# EAGLE design sdEval (EAGLE 4.16)
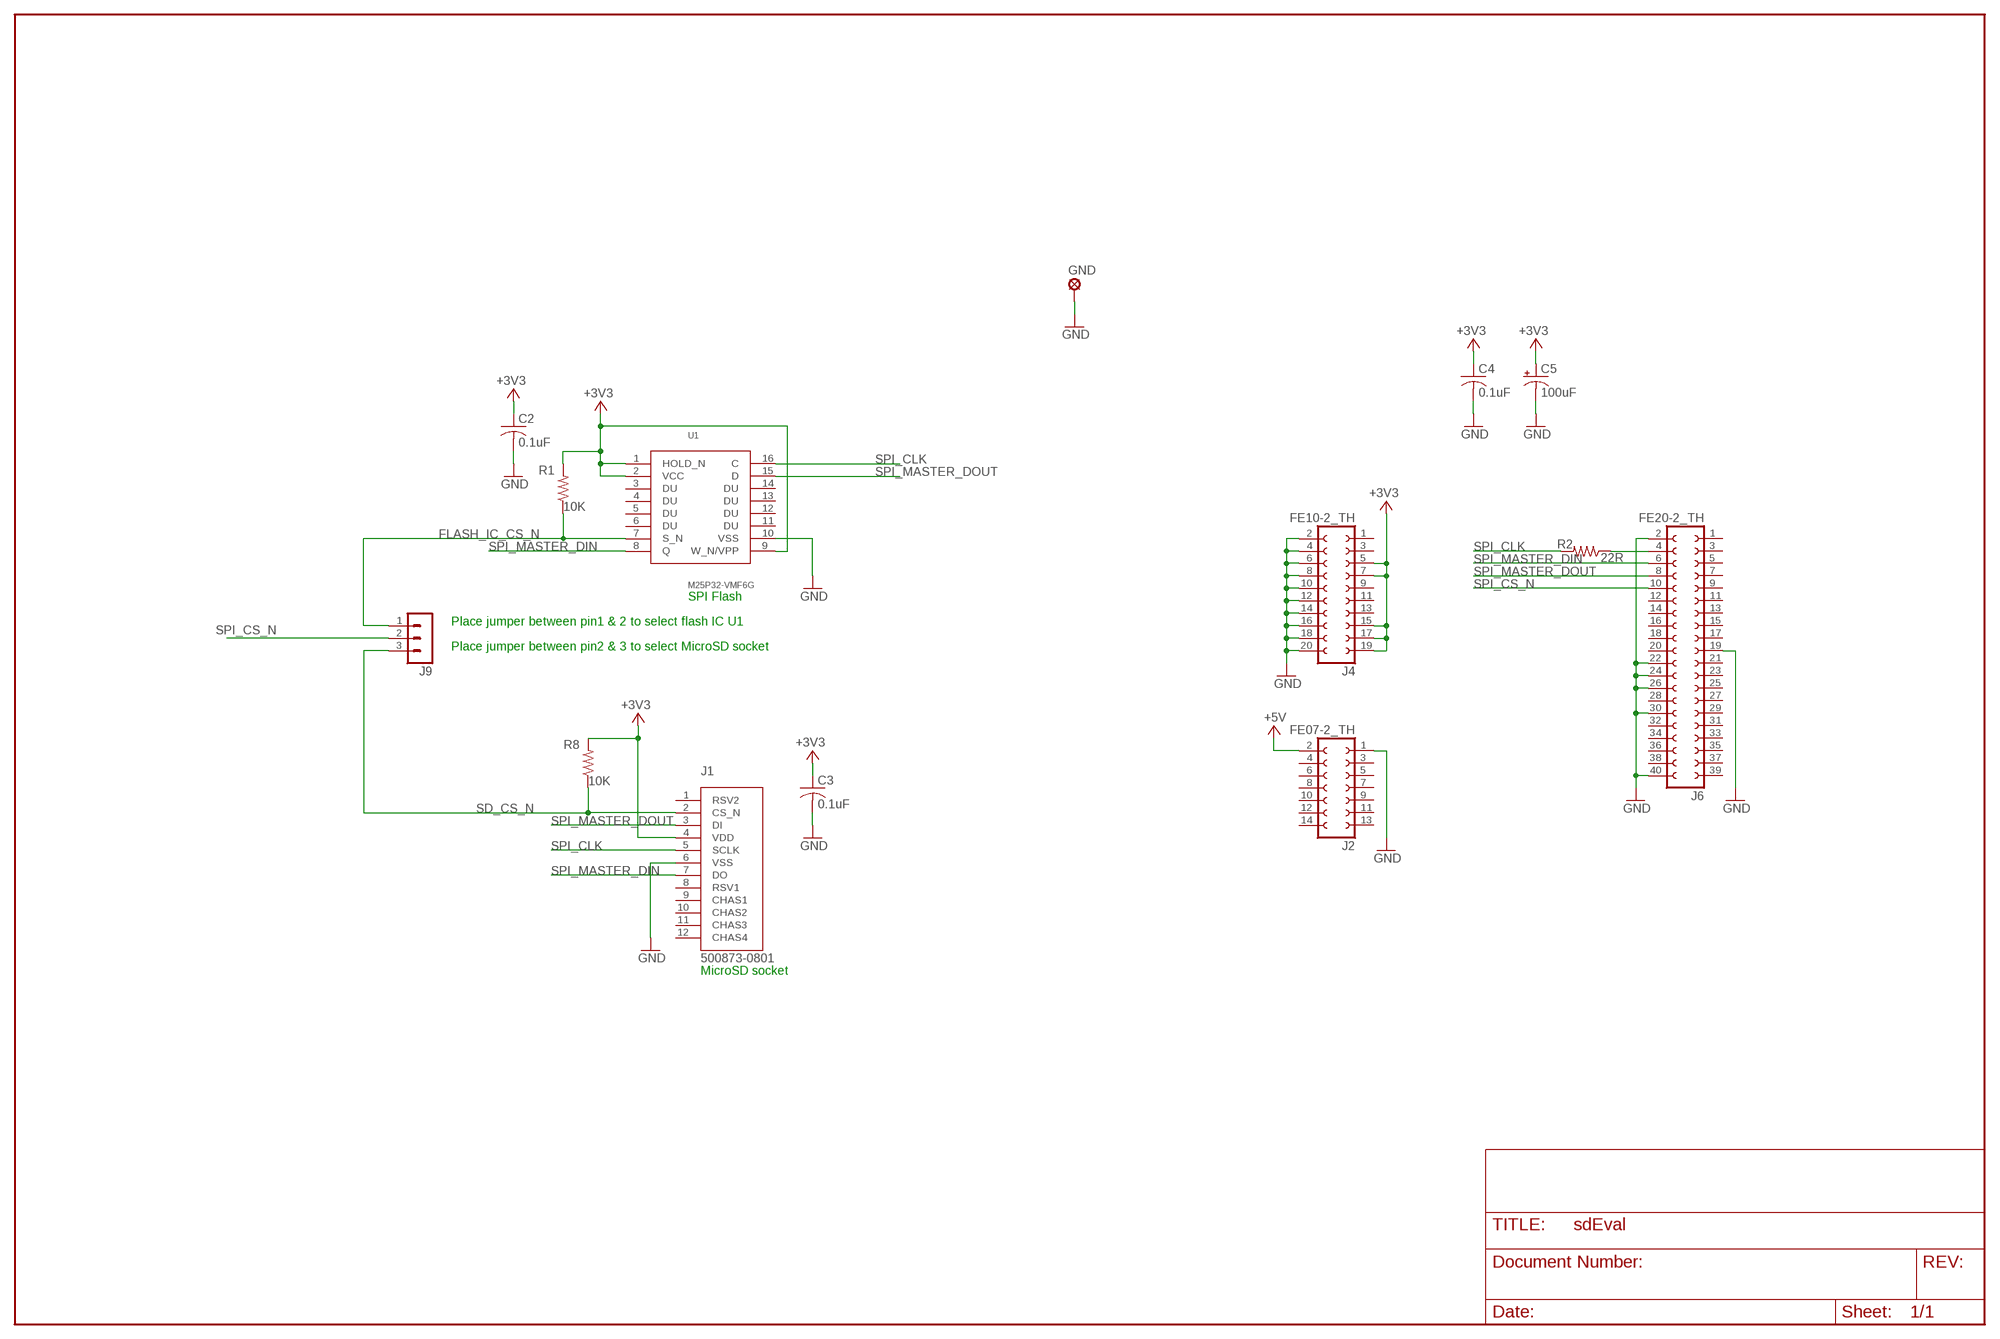
[diagram p0: schematic, sheet 1]

## Parts
C2  0.1uF  C-USC0603  [C0603]
C3  0.1uF  C-USC0603  [C0603]
C4  0.1uF  C-USC0603  [C0603]
C5  100uF  CPOL-USCT3528  [CT3528]
GND  LSP10  [LSP10]
J1  500873-0801  [500873-0801]
J2  FE07-2_TH  [FE07-2_TH]
J4  FE10-2_TH  [FE10-2_TH]
J6  FE20-2_TH  [FE20-2_TH]
J9  MA03-1  [MA03-1]
R1  10K  R-US_R0603  [R0603]
R2  22R  R-US_R0603  [R0603]
R8  10K  R-US_R0603  [R0603]
U1  M25P32-VMF6G  [SO16]

## Nets
+3V3: C2.1 C3.1 C4.1 C5.+ J1.4(VDD) J4.5 J4.7 J4.15 J4.17 J4.19 R1.2 R8.2 U1.1(HOLD_N) U1.2(VCC) U1.9(W_N/VPP)
+5V: J2.2
FLASH_IC_CS_N: J9.1 R1.1 U1.7(S_N)
GND: C2.2 C3.2 C4.2 C5.- GND.MP J1.6(VSS) J2.1 J4.2 J4.4 J4.6 J4.8 J4.10 J4.12 J4.14 J4.16 J4.18 J4.20 J6.2 J6.19 J6.22 J6.24 J6.26 J6.30 J6.40 U1.10(VSS)
N$1: J6.4 R2.1
SD_CS_N: J1.2(CS_N) J9.3 R8.1
SPI_CLK: J1.5(SCLK) R2.2 U1.16(C)
SPI_CS_N: J6.10 J9.2
SPI_MASTER_DIN: J1.7(DO) J6.6 U1.8(Q)
SPI_MASTER_DOUT: J1.3(DI) J6.8 U1.15(D)
Unconnected: J1.1(RSV2) J1.8(RSV1) J1.9(CHAS1) J1.10(CHAS2) J1.11(CHAS3) J1.12(CHAS4) J2.3 J2.4 J2.5 J2.6 J2.7 J2.8 J2.9 J2.10 J2.11 J2.12 J2.13 J2.14 J4.1 J4.3 J4.9 J4.11 J4.13 J6.1 J6.3 J6.5 J6.7 J6.9 J6.11 J6.12 J6.13 J6.14 J6.15 J6.16 J6.17 J6.18 J6.20 J6.21 J6.23 J6.25 J6.27 J6.28 J6.29 J6.31 J6.32 J6.33 J6.34 J6.35 J6.36 J6.37 J6.38 J6.39 U1.3(DU) U1.4(DU) U1.5(DU) U1.6(DU) U1.11(DU) U1.12(DU) U1.13(DU) U1.14(DU)

## Notes on the sheet
- SPI Flash
- Place jumper between pin1 & 2 to select flash IC U1
- Place jumper between pin2 & 3 to select MicroSD socket
- MicroSD socket

## Library data of the parts
C2-C4 = rcl:C-US: CAPACITOR, American symbol
C5 = rcl:CPOL-US: POLARIZED CAPACITOR, American symbol
GND = solpad:LSP10: SOLDER PAD drill 1.0 mm, distributor Buerklin, 12H555
J1 = base2designs:500873-0801: Molex MicroSD socket
J2 = base2designs:FE07-2_TH
J4 = base2designs:FE10-2_TH
J6 = base2designs:FE20-2_TH
J9 = con-lstb:MA03-1: PIN HEADER
R1 R2 R8 = rcl:R-US_: RESISTOR, American symbol
U1 = base2designs:M25P32-VMF6G

## Board
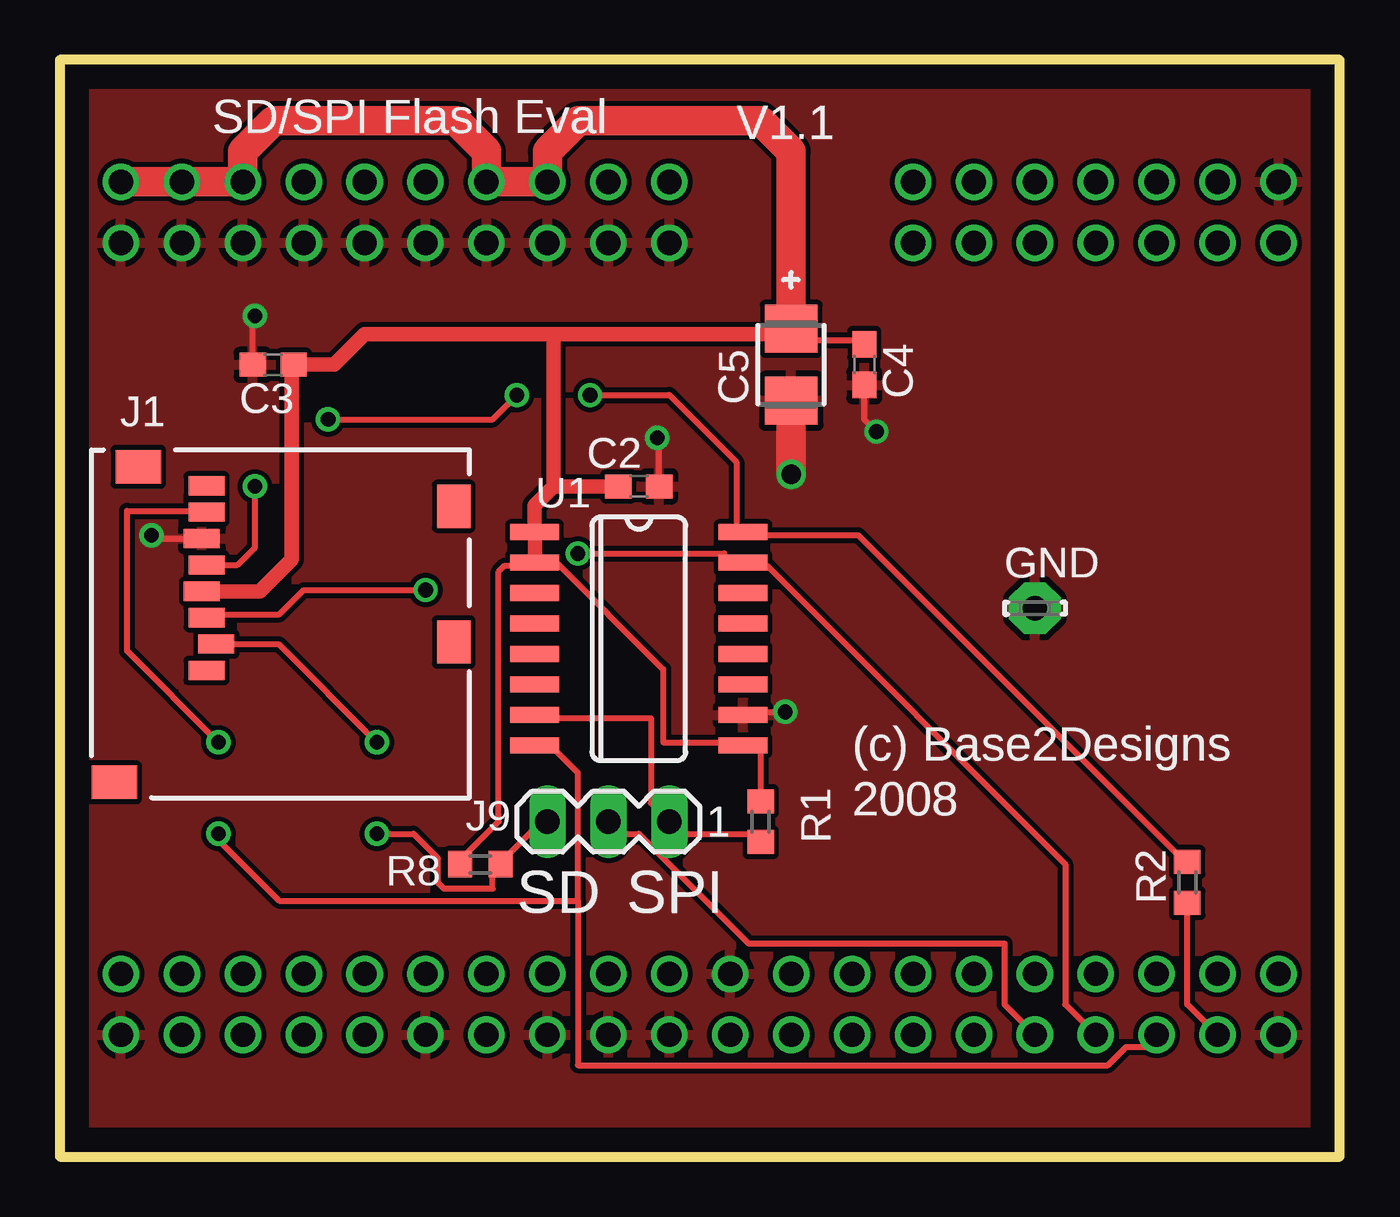
[diagram p1: board, top side]
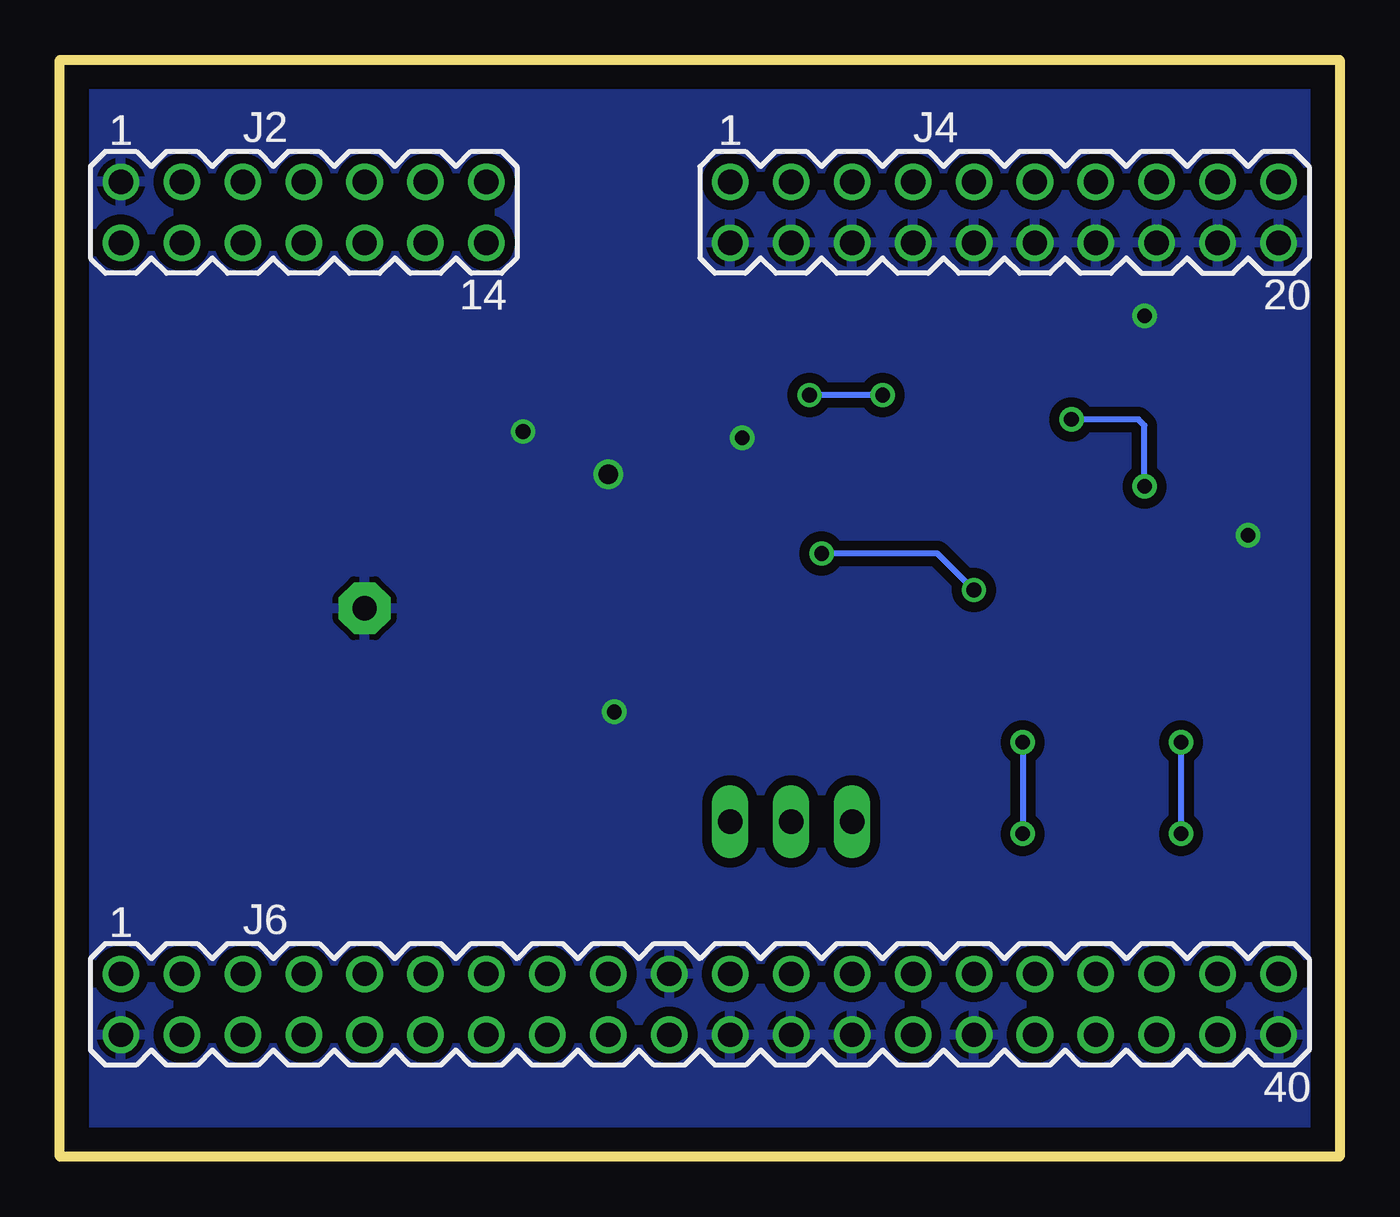
[diagram p2: board, bottom side, seen from below]

Size 53.34 x 45.72 mm. Coordinates in mm from the lower left corner, seen from the top.
Outline: 0,0 53.34,0 53.34,45.72 0,45.72 0,0
Copper layers (1*16): Top 0.035mm / dielectric 1.5mm / Bottom 0.035mm
Design rules "default": minimum track width 10mil, minimum drill 24mil, track to track 8mil, track to pad 8mil, pad to pad 8mil, via to via 8mil, smd to smd 8mil, copper to edge 40mil, drill to drill 8mil, minimum pad ring 10mil, minimum via ring 8mil, stop-mask expansion 3mil, vias tented up to drill 40mil, thermal gap 10mil

### Footprints (pad centres in the part's own frame; a part is rotated, then mirrored left to right if it is on the bottom)
C0603 = smd 1.1 x 1: 1 -0.85,0; 2 0.85,0
CT3528 = smd 2 x 2.2: + 1.5,0; - -1.5,0
LSP10 = drill 1.016 pad 2.159 octagon: MP 0,0
500873-0801 = smd 0.8 x 1.5: 1 -8.94,10.7; 2 -7.84,10.3; 3 -6.74,10.7; 4 -5.64,10.9; 5 -4.54,10.7; 6 -3.44,10.9; 7 -2.34,10.7; 8 -1.24,10.7 | smd 1.4 x 1.9: 9 -13.6,14.55; 10 -0.45,13.55 | smd 1.8 x 1.4: 11 -7.75,0.4; 12 -2.1,0.4
FE07-2_TH = drill 1.016 pad 1.397 round: 1 -7.62,1.27; 2 -7.62,-1.27; 3 -5.08,1.27; 4 -5.08,-1.27; 5 -2.54,1.27; 6 -2.54,-1.27; 7 0,1.27; 8 0,-1.27; 9 2.54,1.27; 10 2.54,-1.27; 11 5.08,1.27; 12 5.08,-1.27; 13 7.62,1.27; 14 7.62,-1.27
FE10-2_TH = drill 1.016 pad 1.397 round: 1 -11.43,1.27; 2 -11.43,-1.27; 3 -8.89,1.27; 4 -8.89,-1.27; 5 -6.35,1.27; 6 -6.35,-1.27; 7 -3.81,1.27; 8 -3.81,-1.27; 9 -1.27,1.27; 10 -1.27,-1.27; 11 1.27,1.27; 12 1.27,-1.27; 13 3.81,1.27; 14 3.81,-1.27; 15 6.35,1.27; 16 6.35,-1.27; 17 8.89,1.27; 18 8.89,-1.27; 19 11.43,1.27; 20 11.43,-1.27
FE20-2_TH = drill 1.016 pad 1.397 round: 1 -24.13,1.27; 2 -24.13,-1.27; 3 -21.59,1.27; 4 -21.59,-1.27; 5 -19.05,1.27; 6 -19.05,-1.27; 7 -16.51,1.27; 8 -16.51,-1.27; 9 -13.97,1.27; 10 -13.97,-1.27; 11 -11.43,1.27; 12 -11.43,-1.27; 13 -8.89,1.27; 14 -8.89,-1.27; 15 -6.35,1.27; 16 -6.35,-1.27; 17 -3.81,1.27; 18 -3.81,-1.27; 19 -1.27,1.27; 20 -1.27,-1.27; 21 1.27,1.27; 22 1.27,-1.27; 23 3.81,1.27; 24 3.81,-1.27; 25 6.35,1.27; 26 6.35,-1.27; 27 8.89,1.27; 28 8.89,-1.27; 29 11.43,1.27; 30 11.43,-1.27; 31 13.97,1.27; 32 13.97,-1.27; 33 16.51,1.27; 34 16.51,-1.27; 35 19.05,1.27; 36 19.05,-1.27; 37 21.59,1.27; 38 21.59,-1.27; 39 24.13,1.27; 40 24.13,-1.27
MA03-1 = drill 1.016 long: 1 -2.54,0; 2 0,0; 3 2.54,0
R0603 = smd 1 x 1.1: 1 -0.85,0; 2 0.85,0
SO16 = smd 0.66 x 2.032: 1 -4.445,-4.343; 2 -3.175,-4.343; 3 -1.905,-4.343; 4 -0.635,-4.343; 5 0.635,-4.343; 6 1.905,-4.343; 7 3.175,-4.343; 8 4.445,-4.343; 9 4.445,4.343; 10 3.175,4.343; 11 1.905,4.343; 12 0.635,4.343; 13 -0.635,4.343; 14 -1.905,4.343; 15 -3.175,4.343; 16 -4.445,4.343

### Placement (x,y rotation side)
C2  24.13,27.94 0 top
C3  8.89,33.02 180 top
C4  33.53,33.02 270 top
C5  30.48,33.02 90 top
GND  40.64,22.86 0 top
J1  16.81,29.21 90 top
J2  43.18,39.37 0 bottom
J4  13.97,39.37 0 bottom
J6  26.67,6.35 0 bottom
J9  22.86,13.97 180 top
R1  29.21,13.97 90 top
R2  46.99,11.43 90 top
R8  17.53,12.19 180 top
U1  24.13,21.59 270 top

### Tracks (layer width: path | path; a pad name or v marks a point on that pad's centre or on a via)
+3V3
  Top 0.254: R1.2 29.21,17.02 U1.9 27.69,17.27 25.15,17.27 25.15,20.32 20.57,24.89 U1.2 | R8.2 17.02,12.7 18.29,13.97 18.29,24.38 18.54,24.64 19.81,24.64 19.94,24.77 | 19.81,25.91 U1.1 | U1.2 19.81,24.89 | C4.1 33.27,34.04 31.5,34.04 C5.+ | 8.89,24.13 8.89,23.88 | C3.1 9.65,32.77 | 19.94,24.77 20.07,24.89 | 19.94,24.77 U1.2
  Top 0.61: 19.81,24.89 19.81,25.91 | C5.+ 30.48,34.29 20.57,34.29 | J1.4 8.33,23.57 8.89,24.13 9.4,24.64 | 9.4,24.64 9.53,24.77 | U1.1 19.79,27.15 20.57,27.94 | 23.37,27.94 C2.1 20.57,27.94 | 9.65,32.77 9.65,24.89 9.4,24.64 | 20.57,27.94 20.57,34.29 | 20.57,34.29 12.7,34.29 11.43,33.02 C3.1 9.65,33.02
  Top 1.219: C5.+ 30.48,41.91 29.21,43.18 21.59,43.18 20.32,41.91 J4.5 J4.7 17.78,41.91 16.51,43.18 8.89,43.18 7.62,41.91 J4.15 J4.17 J4.19
FLASH_IC_CS_N
  Top 0.254: R1.1 28.7,13.46 25.91,13.46 J9.1 24.64,14.73 24.64,18.29 20.57,18.29 U1.7
GND  (via drill 0.61, 0.81)
  Top 0.254: C2.2 24.98,29.88 v24.89,29.97 | C3.2 8.04,34.96 v8.13,35.05 | J1.6 3.95,25.77 v3.81,25.91 | C4.2 33.53,30.73 v34.04,30.23 | v30.23,18.54 29.46,18.54 U1.10
  Top 1.219: v30.48,28.45 C5.-
  pour Bottom (isolate 0.406): 0,45.72 53.34,45.72 53.34,0 0,0
  pour Top: 0,45.72 53.34,45.72 53.34,0 0,0
N$1
  Top 0.254: R2.1 46.99,6.35 J6.4
SD_CS_N  (via drill 0.61)
  Top 0.254: J9.3 19.81,13.72 18.8,12.7 R8.1 18.03,11.68 18.03,11.18 16,11.18 15.75,11.43 15.75,12.45 14.73,13.46 v13.21,13.46 | J1.2 9.11,21.37 v13.21,17.27
  Bottom 0.254: v13.21,17.27 v13.21,13.46
SPI_CLK  (via drill 0.61)
  Top 0.254: R2.2 46.48,12.7 33.27,25.91 29.46,25.91 U1.16 28.47,25.93 28.45,25.91 28.19,26.16 28.19,28.96 25.4,31.75 v22.1,31.75 | J1.5 7.4,24.67 8.13,25.4 v8.13,27.94 | v11.18,30.73 18.03,30.73 v19.05,31.75
  Bottom 0.254: v8.13,27.94 8.13,30.48 8.38,30.73 v11.18,30.73 | v19.05,31.75 v22.1,31.75
SPI_CS_N
  Top 0.254: J9.2 23.37,13.46 24.13,13.46 28.7,8.89 39.37,8.89 39.37,6.35 J6.10
SPI_MASTER_DIN  (via drill 0.61)
  Top 0.254: 21.59,10.67 21.59,16 20.57,17.02 U1.8 | J1.7 5.59,26.92 2.79,26.92 2.79,21.08 v6.6,17.27 | 21.59,10.67 21.59,3.81 43.69,3.81 44.45,4.57 45.21,4.57 J6.6 | v6.6,13.46 6.6,13.21 9.14,10.67 21.59,10.67
  Bottom 0.254: v6.6,13.46 v6.6,17.27
SPI_MASTER_DOUT  (via drill 0.61)
  Top 0.254: v21.59,25.15 27.69,25.15 27.69,24.89 U1.15 29.46,24.64 41.91,12.19 41.91,6.35 J6.8 | v15.24,23.62 10.16,23.62 9.14,22.61 6.35,22.61 6.12,22.37 | 6.12,22.37 6.1,22.35 | J1.3 6.12,22.37
  Bottom 0.254: v21.59,25.15 16.76,25.15 v15.24,23.62

### Text on the board
tPlace: SD/SPI Flash Eval | V1.1 | (c) Base2Designs | 2008 | SD | SPI
_tsilk: SD/SPI Flash Eval | V1.1 | C4 | J1 | C3 | C5 | C2 | U1 | GND | (c) Base2Designs | J9 | 1 | 2008 | R8 | R1 | R2 | SD | SPI
_bsilk: J4 | 1 | J2 | 1 | 20 | 14 | J6 | 1 | 40